# EAGLE design PSPD_driver (EAGLE 9.2.2)
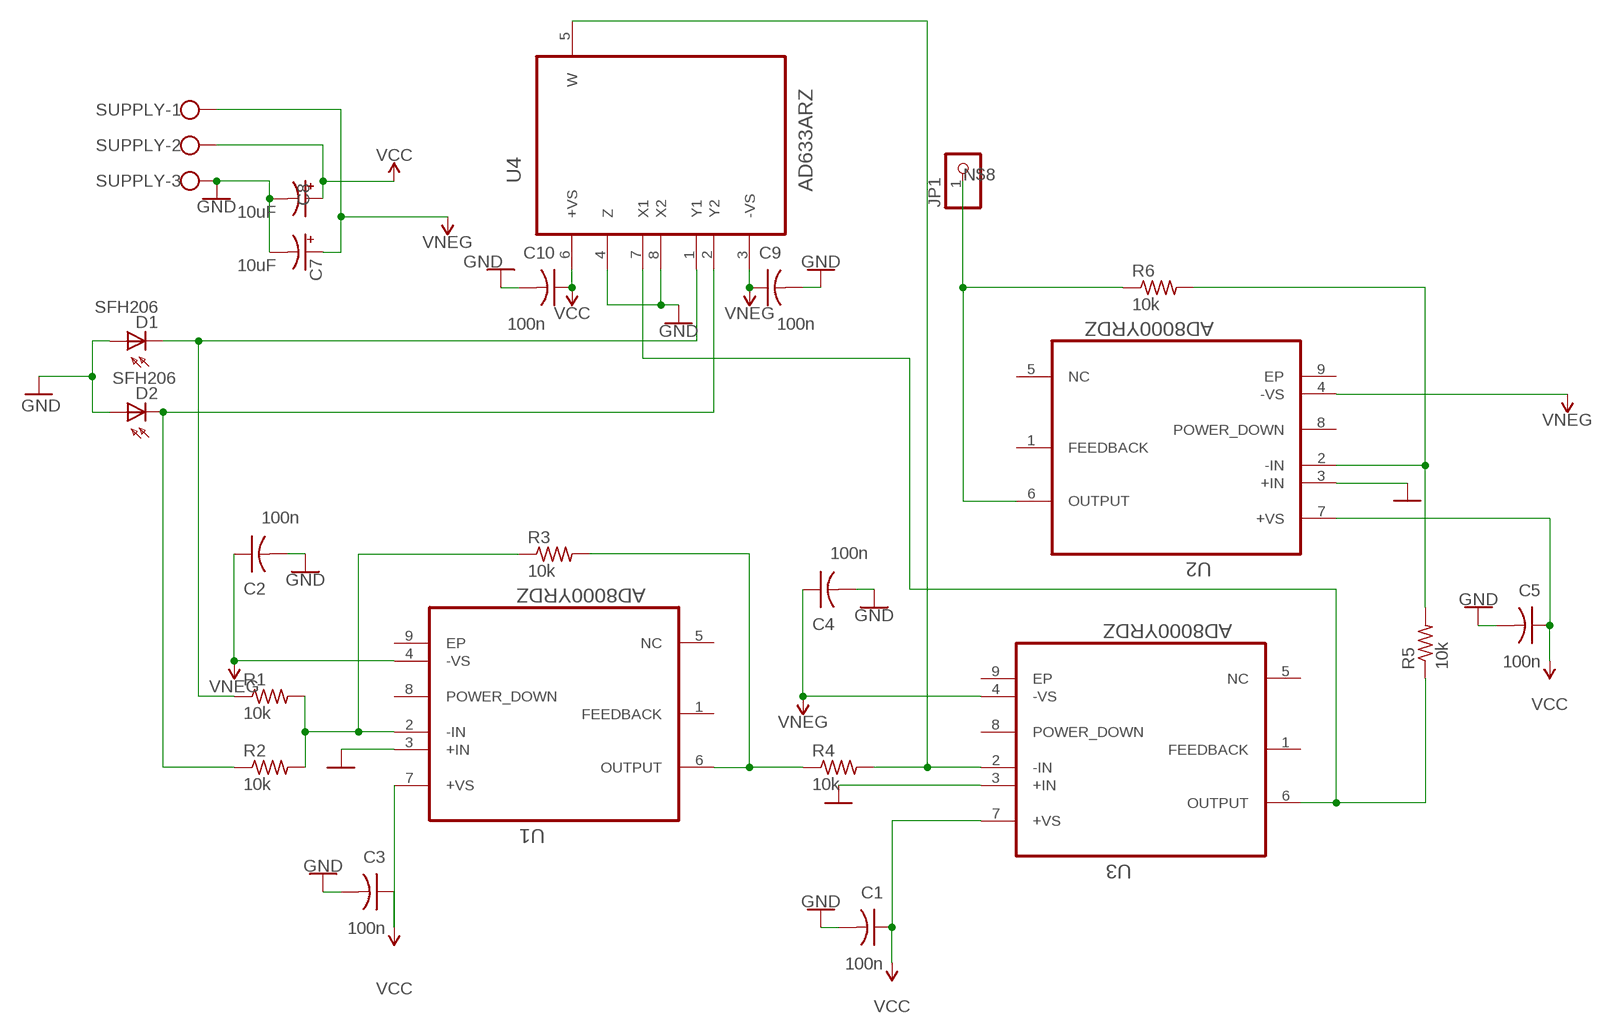
[diagram p0: schematic, sheet 1]

## Parts
C1  100n  C-USC0805K  [C0805K]
C2  100n  C-USC0805K  [C0805K]
C3  100n  C-USC0805K  [C0805K]
C4  100n  C-USC0805K  [C0805K]
C5  100n  C-USC0805K  [C0805K]
C7  10uF  10UF-POLAR-RADIAL-2.5MM-25V-20%  [CPOL-RADIAL-2.5MM-5MM]
C8  10uF  10UF-POLAR-RADIAL-2.5MM-25V-20%  [CPOL-RADIAL-2.5MM-5MM]
C9  100n  C-USC0805K  [C0805K]
C10  100n  C-USC0805K  [C0805K]
D1  SFH206  [SFH206]
D2  SFH206  [SFH206]
JP1  PINHD-1X1  [1X01]
R1  10k  R-US_M0805  [M0805]
R2  10k  R-US_M0805  [M0805]
R3  10k  R-US_M0805  [M0805]
R4  10k  R-US_M0805  [M0805]
R5  10k  R-US_M0805  [M0805]
R6  10k  R-US_M0805  [M0805]
SUPPLY  W237-103  [W237-103]
U1  AD8000YRDZ  [SOIC127P600X175-9N]
U2  AD8000YRDZ  [SOIC127P600X175-9N]
U3  AD8000YRDZ  [SOIC127P600X175-9N]
U4  AD633ARZ  [SOIC127P600X175-8N]

## Nets
GND: C1.2 C2.2 C3.2 C4.2 C5.2 C7.2(-) C8.2(-) C9.2 C10.2 D1.A D2.A SUPPLY.3 U1.3(+IN) U2.3(+IN) U3.3(+IN) U4.4(Z) U4.8(X2)
N$1: R1.2 R2.2 R3.1 U1.2(-IN)
N$2: D1.K(C) R1.1 U4.1(Y1)
N$3: D2.K(C) R2.1 U4.2(Y2)
N$4: R3.2 R4.1 U1.6(OUTPUT)
N$5: R4.2 U3.2(-IN) U4.5(W)
N$6: R5.1 U3.6(OUTPUT) U4.7(X1)
N$7: R5.2 R6.2 U2.2(-IN)
N$8: JP1.1 R6.1 U2.6(OUTPUT)
VCC: C1.1 C3.1 C5.1 C8.1(+) C10.1 SUPPLY.2 U1.7(+VS) U2.7(+VS) U3.7(+VS) U4.6(+VS)
VNEG: C2.1 C4.1 C7.1(+) C9.1 SUPPLY.1 U1.4(-VS) U2.4(-VS) U3.4(-VS) U4.3(-VS)
Unconnected: U1.1(FEEDBACK) U1.5(NC) U1.8(POWER_DOWN) U1.9(EP) U2.1(FEEDBACK) U2.5(NC) U2.8(POWER_DOWN) U2.9(EP) U3.1(FEEDBACK) U3.5(NC) U3.8(POWER_DOWN) U3.9(EP)

## Library data of the parts
C1-C5 C9 C10 = rcl:C-US: CAPACITOR, American symbol; SPICEPREFIX: C
C7 C8 = SparkFun-Capacitors:10UF-POLAR: 10.0µF polarized capacitors A capacitor is a passive two-terminal electrical component used to store electrical energy temporarily in an electric field.; PROD_ID: CAP-08440
D1 D2 = opto-trans-siemens:SFH206: PHOTO DIODE; MPN: SFH206K; OC_FARNELL: 1212741; OC_NEWARK: 01M8807
JP1 = pinhead:PINHD-1X1: PIN HEADER
R1-R6 = resistor:R-US_: RESISTOR, American symbol
SUPPLY = con-wago-500:W237-103: WAGO SCREW CLAMP; MPN: 237-103; OC_FARNELL: unknown; OC_NEWARK: 18M7116
U1-U3 = AD8000YRDZ:AD8000YRDZ: 1.5 GHz Ultrahigh Speed Op Amp SOIC-8; AVAILABILITY: Unavailable; DESCRIPTION: OP Amp Single Current Fdbk ±6V/12V 8-Pin SOIC N EP Tube; MF: Analog Devices; MP: AD8000YRDZ; PACKAGE: SOIC-8 Analog Devices; PRICE: None
U4 = AD633ARZ:AD633ARZ: Analog Multiplier; AVAILABILITY: Unavailable; DESCRIPTION: Low Cost Four-Quadrant Analog Multiplier, 8 Pin Pdip; MF: Analog Devices; MP: AD633ARZ; PACKAGE: SOIC-8 Analog Devices; PRICE: None

## Board
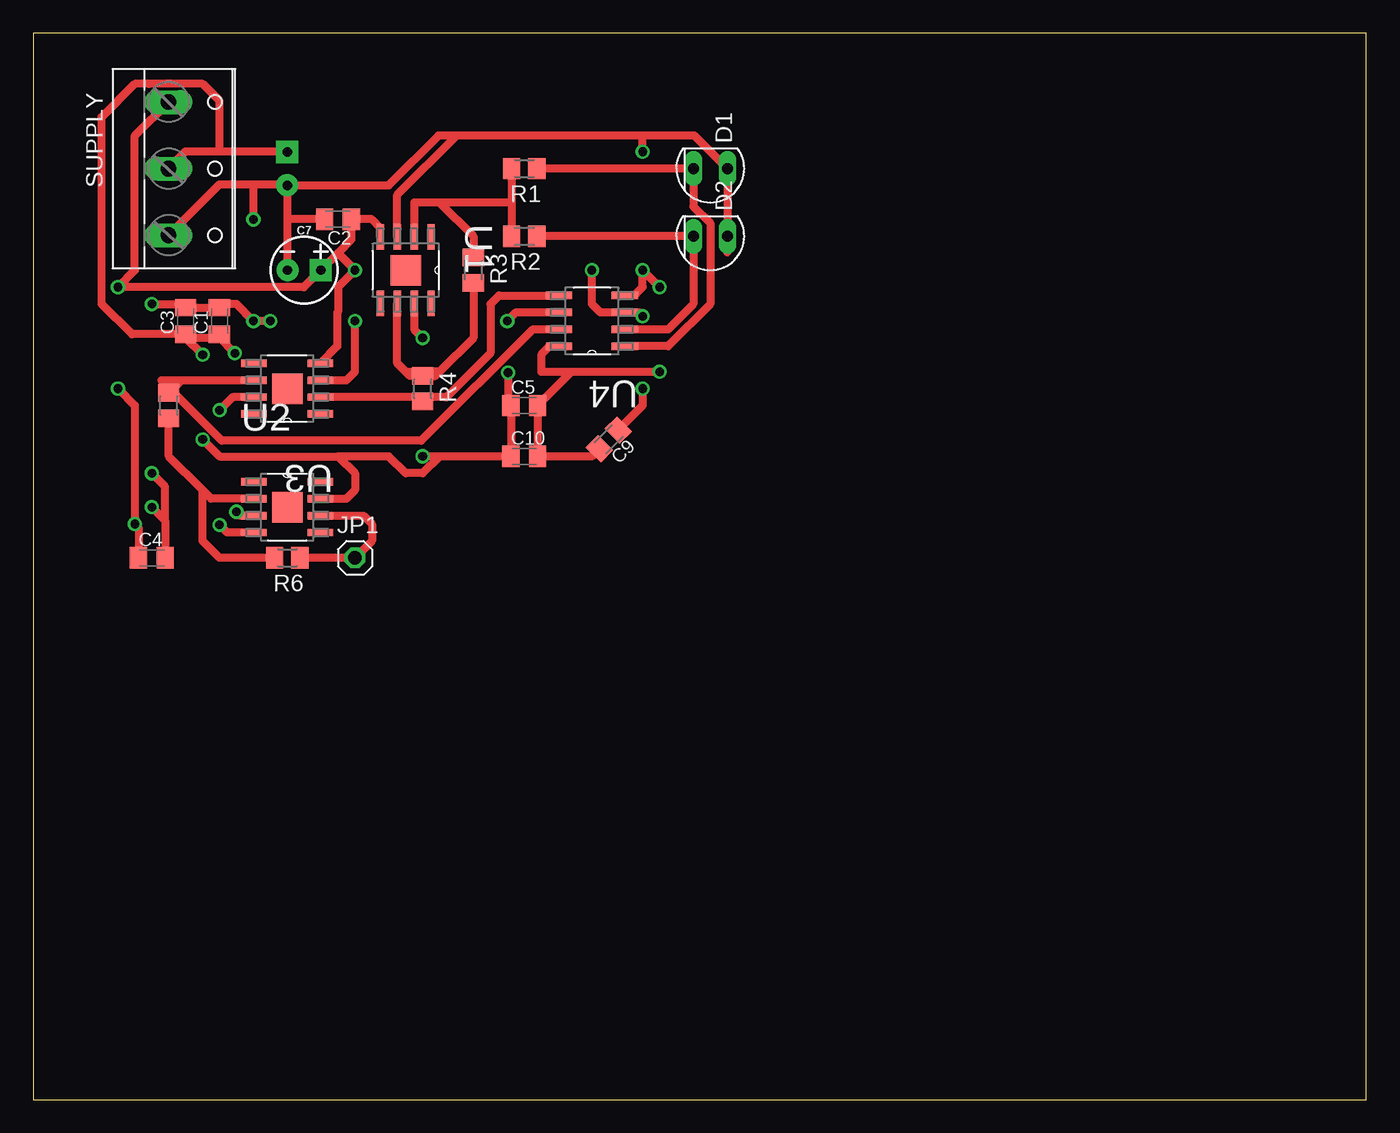
[diagram p1: board, top side]
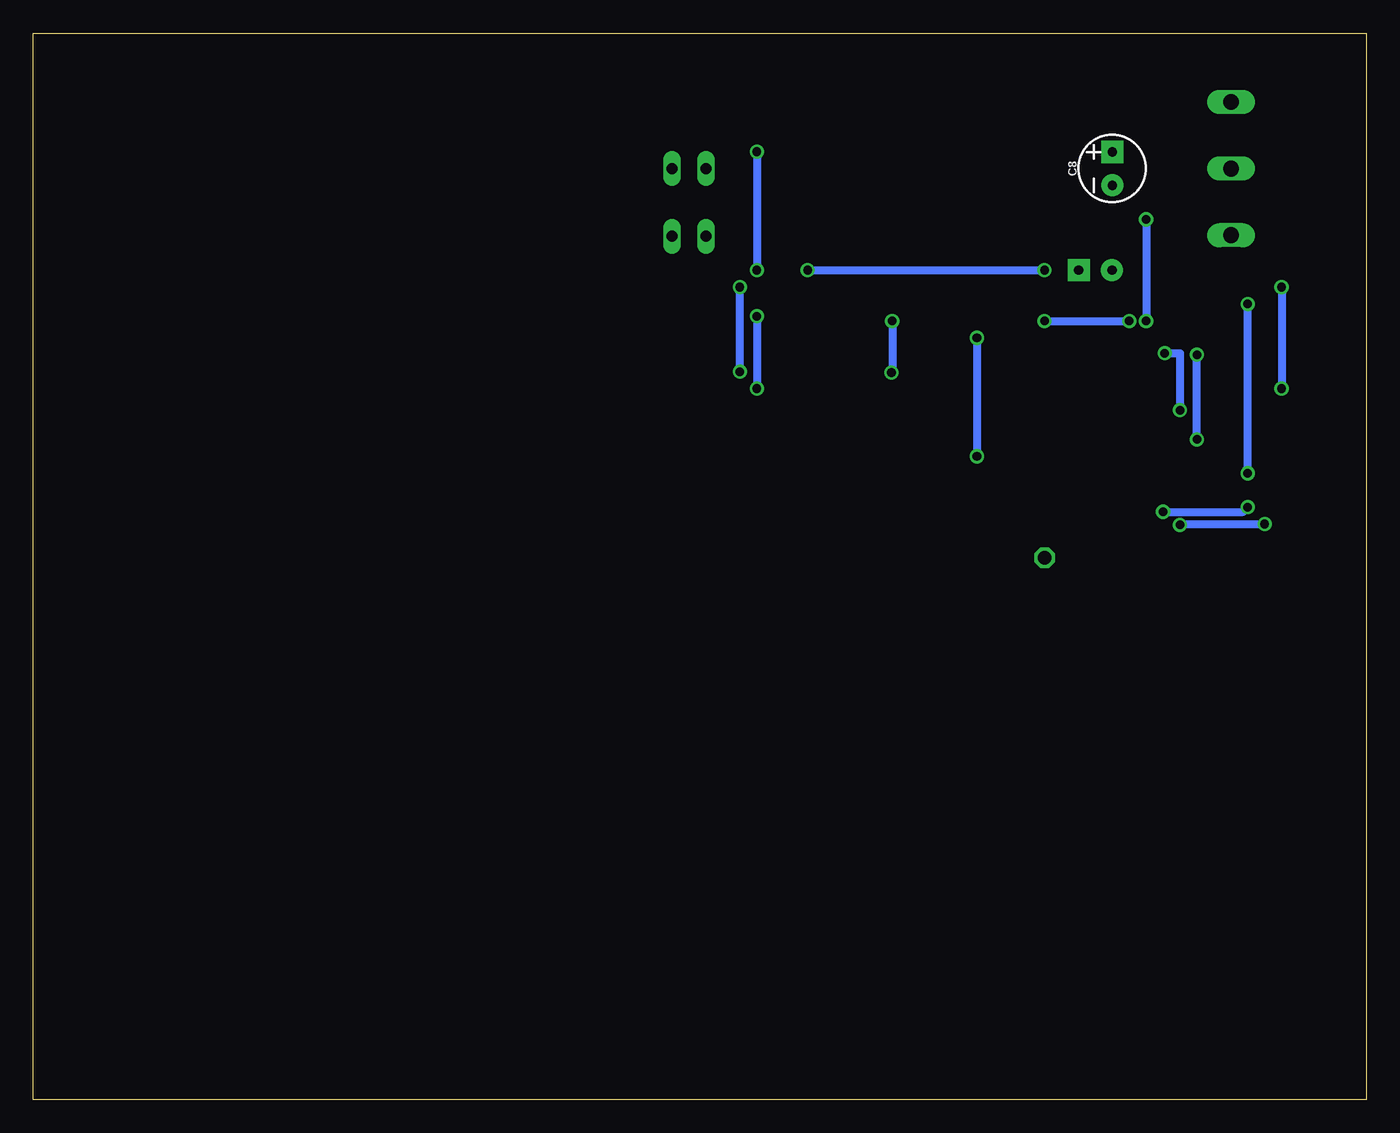
[diagram p2: board, bottom side, seen from below]

Size 100 x 80 mm. Coordinates in mm from the lower left corner, seen from the top.
Outline: 0,0 100,0 100,80 0,80 0,0
Copper layers (1*16): Top 0.035mm / dielectric 1.5mm / Bottom 0.035mm
Design rules "default": minimum track width 6mil, minimum drill 0.35mm, track to track 6mil, track to pad 6mil, pad to pad 6mil, via to via 6mil, smd to smd 6mil, copper to edge 40mil, drill to drill 6mil, minimum pad ring 10mil, minimum via ring 8mil, stop-mask expansion 4mil, vias tented up to drill 0mil, thermal gap 10mil

### Footprints (pad centres in the part's own frame; a part is rotated, then mirrored left to right if it is on the bottom)
C0805K = smd 1.3 x 1.6: 1 -1,0; 2 1,0
CPOL-RADIAL-2.5MM-5MM = drill 0.7 pad 1.651 square: 1 1.25,0 | drill 0.7 pad 1.651: 2 -1.25,0
SFH206 = drill 0.813 long: A 0,-1.27; K 0,1.27
1X01 = drill 1.016 octagon: 1 0,0
M0805 = smd 1.3 x 1.6: 1 -0.95,0; 2 0.95,0
W237-103 = drill 1.194 long: 1 -5,-1.29; 2 0,-1.29; 3 5,-1.29
SOIC127P600X175-9N = smd 1.905 x 0.559: 1 -2.489,1.905; 2 -2.489,0.635; 3 -2.489,-0.635; 4 -2.489,-1.905; 5 2.489,-1.905; 6 2.489,-0.635; 7 2.489,0.635; 8 2.489,1.905 | smd 2.286 x 2.286: 9 0,0
SOIC127P600X175-8N = smd 1.981 x 0.559: 1 -2.464,1.905; 2 -2.464,0.635; 3 -2.464,-0.635; 4 -2.464,-1.905; 5 2.464,-1.905; 6 2.464,-0.635; 7 2.464,0.635; 8 2.464,1.905

### Placement (x,y rotation side)
C1  13.97,58.42 90 top
C2  22.86,66.04 180 top
C3  11.43,58.42 90 top
C4  8.89,40.64 0 top
C5  36.83,52.07 0 top
C7  20.32,62.23 0 top
C8  19.05,69.85 90 bottom
C9  43.18,49.53 225 top
C10  36.83,48.26 0 top
D1  50.8,69.85 90 top
D2  50.8,64.77 90 top
JP1  24.13,40.64 0 top
R1  36.83,69.85 180 top
R2  36.83,64.77 180 top
R3  33.02,62.23 270 top
R4  29.21,53.34 270 top
R5  10.16,52.07 270 top
R6  19.05,40.64 180 top
SUPPLY  11.43,69.85 270 top
U1  27.94,62.23 270 top
U2  19.05,44.45 0 top
U3  19.05,53.34 180 top
U4  41.91,58.42 180 top

### Tracks (layer width: path | path; a pad name or v marks a point on that pad's centre or on a via)
GND  (via drill 0.65)
  Top 0.61: C8.2 18.99,68.66 16.51,68.66 | 16.51,68.66 13.95,68.66 SUPPLY.3 | C7.2 19.07,66.04 | 19.07,66.04 19.07,68.59 C8.2 | C8.2 26.67,68.6 30.4,72.33 31.75,72.33 | U1.3 27.3,67.88 31.75,72.33 | C2.2 19.07,66.04 | 52.07,63.55 D2.A D1.A 49.59,72.33 45.72,72.33 | 45.72,72.33 31.75,72.33 | v45.72,71.12 45.72,72.33 | U4.4 45.09,60.33 45.72,60.96 v45.72,62.23 v46.99,60.96 | U4.8 38.73,56.52 38.1,55.88 38.1,54.61 v46.99,54.61 40.37,54.61 C5.2 C10.2 41.91,48.26 C9.2 | 16.51,68.66 v16.51,66.04 | U3.3 23.5,53.98 24.13,54.61 v24.13,58.42 | v17.78,58.42 v16.51,58.42 15.24,59.69 14.24,59.69 C1.2 C3.2 11.16,59.69 v8.89,59.69 | U2.3 15.53,43.81 v15.24,44.1 | 9.89,43.45 C4.2 | 9.89,43.45 v8.89,44.45 | 9.89,43.45 9.89,45.99 v8.89,46.99
  Bottom 0.61: v45.72,71.12 v45.72,62.23 | v46.99,54.61 v46.99,60.96 | v16.51,66.04 v16.51,58.42 | v24.13,58.42 v17.78,58.42 | v15.24,44.1 9.24,44.1 v8.89,44.45 | v8.89,46.99 v8.89,59.69
N$1
  Top 0.61: R1.2 35.88,67.31 | 35.88,67.31 R2.2 | 35.88,67.31 30.48,67.31 | 30.48,67.31 28.57,67.31 U1.2 | 30.48,67.31 33.02,64.77 R3.1
N$2
  Top 0.61: R1.1 D1.K 49.53,67.01 50.8,65.74 50.8,59.69 47.62,56.52 U4.1
N$3
  Top 0.61: R2.1 D2.K 49.53,59.69 47.62,57.78 U4.2
N$4
  Top 0.61: R3.2 33.02,57.15 30.48,54.61 | U1.6 27.3,55.24 27.94,54.61 | 30.48,54.61 29.53,54.61 | 29.53,54.61 R4.1 | R4.1 28.26,54.29 27.94,54.61 | 27.94,54.61 29.53,54.61 | R4.1 30.16,54.29 30.48,54.61
N$5
  Top 0.61: R4.2 28.89,52.7 | 28.89,52.7 U3.2 | U4.5 34.92,60.33 34.29,59.69 34.29,56 30.99,52.7 28.89,52.7
N$6
  Top 0.61: 11.12,53.98 9.6,53.98 14.15,49.43 29.11,49.43 37.47,57.78 U4.7 | 11.12,53.98 U3.6 | 11.12,53.98 R5.1
N$7
  Top 0.61: U2.2 13.34,45.09 12.7,45.72 | 12.7,45.72 10.16,48.26 R5.2 | R6.2 13.97,40.64 12.7,41.91 12.7,45.72
N$8
  Top 0.61: U2.6 24.77,43.81 25.4,43.18 25.4,41.91 JP1.1 R6.1
VCC  (via drill 0.65)
  Top 0.61: C8.1 19.03,71.12 13.97,71.12 | 13.97,71.12 11.41,71.12 SUPPLY.2 | 13.97,71.12 13.97,74.93 12.7,76.2 8.68,76.2 7.62,76.2 5.13,73.71 5.13,59.69 7.4,57.42 C3.1 11.43,57.15 | U2.7 23.5,45.09 24.13,45.72 24.13,46.99 22.86,48.26 | 15.88,52.7 U3.7 14.96,52.7 v13.97,51.72 | 22.86,48.26 13.97,48.26 v12.7,49.53 | v15.12,56 13.85,57.27 13.85,57.3 C1.1 13.7,57.15 11.43,57.15 | v12.7,55.88 11.43,57.15 | U1.7 28.57,57.78 v29.21,57.15 | 30.48,48.26 C10.1 C5.1 35.62,52.28 v35.62,54.55 | U4.6 36.2,59.05 v35.56,58.42 | 22.86,48.26 26.67,48.26 27.94,46.99 29.21,46.99 30.48,48.26 | 30.48,48.26 v29.21,48.26
  Bottom 0.61: v15.12,56 13.97,56 v13.97,51.72 | v12.7,49.53 v12.7,55.88 | v29.21,57.15 v29.21,48.26 | v35.56,58.42 35.56,54.61 v35.62,54.55
VNEG  (via drill 0.65)
  Top 0.61: SUPPLY.1 7.62,72.33 7.62,62.23 v6.35,60.96 6.36,60.95 20.29,60.95 C7.1 22.85,63.51 | U1.4 26.04,65.41 25.4,66.04 C2.1 23.86,64.52 22.85,63.51 | v41.91,62.23 41.91,59.69 42.55,59.05 U4.3 45.44,59.05 v45.72,58.77 | 22.85,63.51 v24.13,62.23 22.86,60.96 22.86,59.11 22.81,59.05 22.81,56.52 U3.4 | U2.4 14.54,42.55 v13.97,43.11 | v6.35,53.34 7.62,52.07 v7.62,43.18 7.89,42.91 C4.1 | v45.72,53.34 45.72,52.07 C9.1
  Bottom 0.61: v41.91,62.23 v24.13,62.23 | v13.97,43.11 13.97,43.18 v7.62,43.18 | v6.35,60.96 v6.35,53.34 | v45.72,58.77 v45.72,53.34